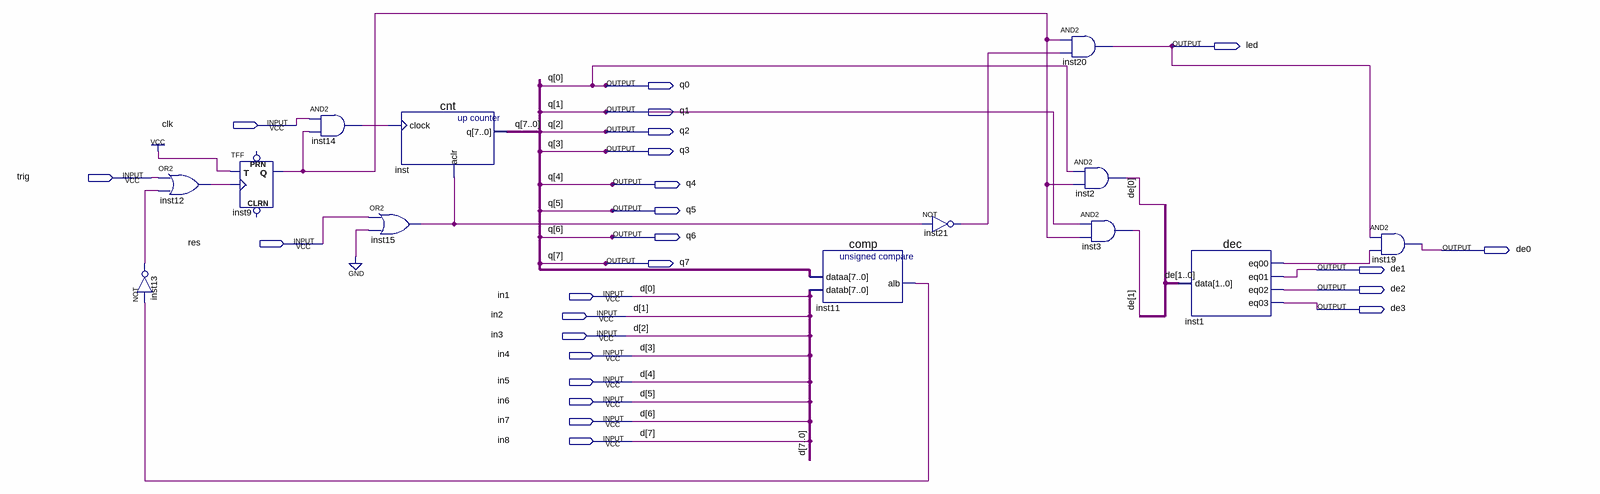
[diagram p0: schematic sheet]
// Quartus schematic 3plus.bdf as structural Verilog: 13 symbols, 24 pins
module \3plus  (
  input  clk,
  input  trig,
  input  res,
  input  in1,
  input  in2,
  input  in3,
  input  in4,
  input  in5,
  input  in6,
  input  in7,
  input  in8,
  output led,
  output q0,
  output q1,
  output q2,
  output q3,
  output q4,
  output q5,
  output q6,
  output de0,
  output q7,
  output de1,
  output de2,
  output de3
);

  wire inst1_eq00, inst9_q, inst11_alb, inst12_out, inst13_out, inst14_out, inst15_out, inst21_out;

  or inst12 (inst12_out, trig, inst13_out);
  not inst13 (inst13_out, inst11_alb);
  TFF inst9 (.T(1'b1), .CLK(inst12_out), .Q(inst9_q));  // open: PRN, CLRN
  and inst14 (inst14_out, clk, inst9_q);
  or inst15 (inst15_out, res, 1'b0);
  cnt inst (.clock(inst14_out), .aclr(inst15_out), .q({q7, q6, q5, q4, q3, q2, q1, q0}));
  comp inst11 (
    .dataa({q7, q6, q5, q4, q3, q2, q1, q0}), .datab({in8, in7, in6, in5, in4, in3, in2, in1}),
    .alb(inst11_alb));
  not inst21 (inst21_out, inst15_out);
  and inst20 (led, inst9_q, inst21_out);
  and inst2 (de0, q0, inst9_q);
  and inst3 (de1, q1, inst9_q);
  dec inst1 (.data({de1, de0}), .eq00(inst1_eq00), .eq01(de1), .eq02(de2), .eq03(de3));
  and inst19 (de0, led, inst1_eq00);

  // Other names for the same wires on the sheet: d[7:0] = {in8, in7, in6, in5, in4, in3, in2, in1}
endmodule
